# Altium schematic sheet MB1635-TOP.SchDoc: TOP
size A3; Date: Not used; ApprovedBy: Not used; CheckedBy: Not used; Author: Not used; CompanyName: STMicroelectronics; DrawnBy: Not used; Engineer: Not used; Organization: Not used; Address1: Not used; Address2: Not used; Address3: Not used; Address4: Not used; DocumentNumber: 2; Revision: Not used; SheetNumber: 2; SheetTotal: 17; CurrentTime: Not used; CurrentDate: Not used; Time: Not used; DocumentFullPathAndName: Not used; DocumentName: Not used; ModifiedDate: Not used; ImagePath: Not used; ProjectName: Not used; Application_BuildNumber: Not used
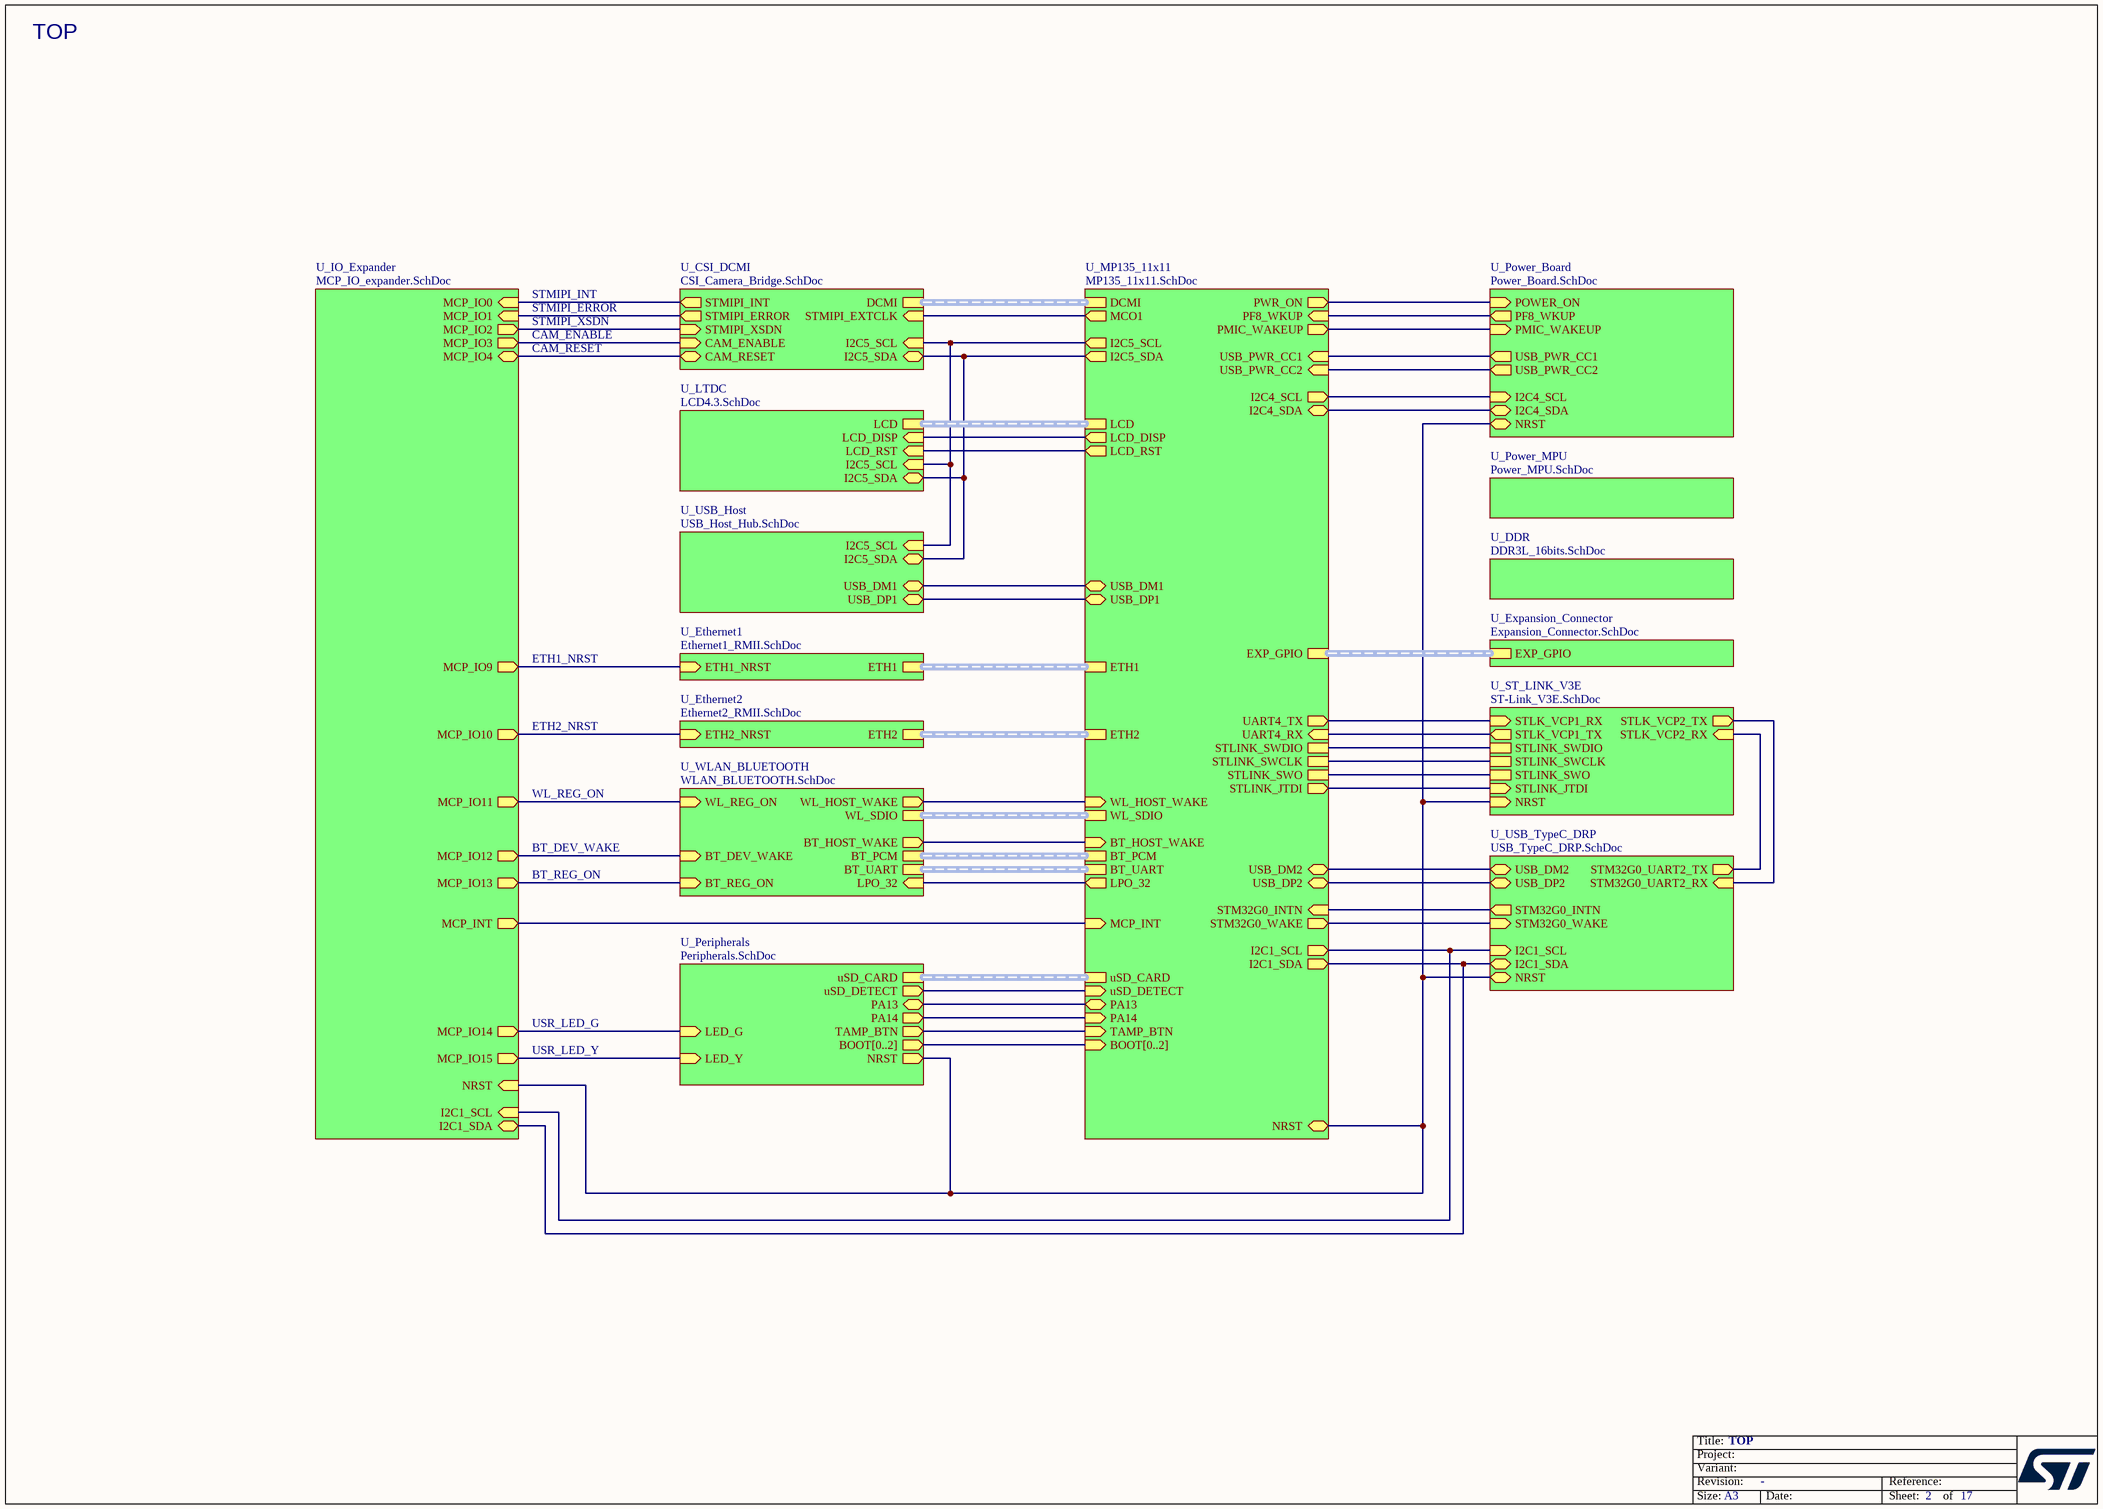
[diagram p0: MB1635-TOP.SchDoc]

## Sub-sheets
U_CSI_DCMI = CSI_Camera_Bridge.SchDoc: DCMI (harness DCMI), I2C5_SCL (in), I2C5_SDA (bidir), STMIPI_EXTCLK (in), STMIPI_ERROR (out), STMIPI_INT (out), CAM_ENABLE (in), CAM_RESET (bidir), STMIPI_XSDN (in)
U_DDR = DDR3L_16bits.SchDoc: no entries
U_Ethernet1 = Ethernet1_RMII.SchDoc: ETH1 (harness ETH1), ETH1_NRST (in)
U_Ethernet2 = Ethernet2_RMII.SchDoc: ETH2 (harness ETH2), ETH2_NRST (in)
U_Expansion_Connector = Expansion_Connector.SchDoc: EXP_GPIO (harness EXP_GPIO)
U_IO_Expander = MCP_IO_expander.SchDoc: MCP_IO1 (in), MCP_IO0 (in), MCP_IO9 (out), MCP_IO10 (out), MCP_IO11 (out), MCP_IO12 (out), MCP_IO13 (out), MCP_IO14 (out), MCP_IO15 (out), I2C1_SCL (in), I2C1_SDA (bidir), MCP_INT (out), NRST (in), MCP_IO3 (out), MCP_IO4 (bidir), MCP_IO2 (out)
U_LTDC = LCD4.3.SchDoc: LCD (harness LCD), I2C5_SCL (in), I2C5_SDA (bidir), LCD_DISP (in), LCD_RST (in)
U_MP135_11x11 = MP135_11x11.SchDoc: uSD_CARD (harness uSD_CARD), PMIC_WAKEUP (out), PF8_WKUP (in), NRST (bidir), PWR_ON (out), ETH2 (harness ETH2), ETH1 (harness ETH1), I2C1_SCL (out), I2C1_SDA (out), I2C4_SCL (out), I2C4_SDA (bidir), UART4_TX (out), UART4_RX (in), LCD (harness LCD), WL_SDIO (harness WL_SDIO), BOOT[0..2] (in), WL_HOST_WAKE (in), BT_HOST_WAKE (in), LPO_32 (out), BT_PCM (harness BT_PCM), BT_UART (harness BT_UART), DCMI (harness DCMI), EXP_GPIO (harness EXP_GPIO), USB_DM1 (bidir), USB_DM2 (bidir), USB_DP1 (bidir), USB_DP2 (bidir), MCO1 (out), USB_PWR_CC1 (in), USB_PWR_CC2 (in), STLINK_SWDIO, STLINK_SWCLK, STLINK_SWO, PA14 (in), PA13 (bidir), STM32G0_INTN (in), STM32G0_WAKE (out), MCP_INT (in), TAMP_BTN (in), uSD_DETECT (in), LCD_DISP (out), LCD_RST (out), I2C5_SCL (out), I2C5_SDA (out), STLINK_JTDI (out)
U_Peripherals = Peripherals.SchDoc: NRST (out), BOOT[0..2] (out), uSD_CARD (harness uSD_CARD), PA13 (bidir), PA14 (out), LED_Y (in), LED_G (in), uSD_DETECT (out), TAMP_BTN (out)
U_Power_Board = Power_Board.SchDoc: I2C4_SDA (bidir), I2C4_SCL (in), PF8_WKUP (out), NRST (bidir), POWER_ON (in), USB_PWR_CC1 (out), USB_PWR_CC2 (out), PMIC_WAKEUP (in)
U_Power_MPU = Power_MPU.SchDoc: no entries
U_ST_LINK_V3E = ST-Link_V3E.SchDoc: STLINK_SWDIO, STLINK_SWCLK, STLINK_SWO, STLK_VCP1_RX (in), STLK_VCP1_TX (out), STLK_VCP2_TX (out), STLK_VCP2_RX (in), NRST (in), STLINK_JTDI (in)
U_USB_Host = USB_Host_Hub.SchDoc: USB_DM1 (bidir), USB_DP1 (bidir), I2C5_SDA (bidir), I2C5_SCL (in)
U_USB_TypeC_DRP = USB_TypeC_DRP.SchDoc: USB_DM2 (bidir), USB_DP2 (bidir), I2C1_SCL (in), I2C1_SDA (bidir), STM32G0_INTN (out), STM32G0_WAKE (in), STM32G0_UART2_TX (out), STM32G0_UART2_RX (in), NRST (bidir)
U_WLAN_BLUETOOTH = WLAN_BLUETOOTH.SchDoc: BT_PCM (harness BT_PCM), BT_UART (harness BT_UART), WL_SDIO (harness WL_SDIO), BT_REG_ON (in), BT_HOST_WAKE (out), BT_DEV_WAKE (in), WL_REG_ON (in), WL_HOST_WAKE (out), LPO_32 (in)

## Nets
(unnamed): sheet U_Ethernet1/ETH1_NRST, sheet U_IO_Expander/MCP_IO9
(unnamed): sheet U_Ethernet2/ETH2_NRST, sheet U_IO_Expander/MCP_IO10
(unnamed): sheet U_Power_Board/I2C4_SDA, sheet U_MP135_11x11/I2C4_SDA
(unnamed): sheet U_Power_Board/I2C4_SCL, sheet U_MP135_11x11/I2C4_SCL
(unnamed): sheet U_Power_Board/PF8_WKUP, sheet U_MP135_11x11/PF8_WKUP
(unnamed): sheet U_Power_Board/NRST, sheet U_ST_LINK_V3E/NRST, sheet U_Peripherals/NRST, sheet U_MP135_11x11/NRST, sheet U_IO_Expander/NRST, sheet U_USB_TypeC_DRP/NRST
(unnamed): sheet U_Power_Board/POWER_ON, sheet U_MP135_11x11/PWR_ON
(unnamed): sheet U_Power_Board/USB_PWR_CC1, sheet U_MP135_11x11/USB_PWR_CC1
(unnamed): sheet U_Power_Board/USB_PWR_CC2, sheet U_MP135_11x11/USB_PWR_CC2
(unnamed): sheet U_Power_Board/PMIC_WAKEUP, sheet U_MP135_11x11/PMIC_WAKEUP
(unnamed): sheet U_ST_LINK_V3E/STLINK_SWDIO, sheet U_MP135_11x11/STLINK_SWDIO
(unnamed): sheet U_ST_LINK_V3E/STLINK_SWCLK, sheet U_MP135_11x11/STLINK_SWCLK
(unnamed): sheet U_ST_LINK_V3E/STLINK_SWO, sheet U_MP135_11x11/STLINK_SWO
(unnamed): sheet U_ST_LINK_V3E/STLK_VCP1_RX, sheet U_MP135_11x11/UART4_TX
(unnamed): sheet U_ST_LINK_V3E/STLK_VCP1_TX, sheet U_MP135_11x11/UART4_RX
(unnamed): sheet U_ST_LINK_V3E/STLK_VCP2_TX, sheet U_USB_TypeC_DRP/STM32G0_UART2_RX
(unnamed): sheet U_ST_LINK_V3E/STLK_VCP2_RX, sheet U_USB_TypeC_DRP/STM32G0_UART2_TX
(unnamed): sheet U_ST_LINK_V3E/STLINK_JTDI, sheet U_MP135_11x11/STLINK_JTDI
(unnamed): sheet U_WLAN_BLUETOOTH/BT_REG_ON, sheet U_IO_Expander/MCP_IO13
(unnamed): sheet U_WLAN_BLUETOOTH/BT_HOST_WAKE, sheet U_MP135_11x11/BT_HOST_WAKE
(unnamed): sheet U_WLAN_BLUETOOTH/BT_DEV_WAKE, sheet U_IO_Expander/MCP_IO12
(unnamed): sheet U_WLAN_BLUETOOTH/WL_REG_ON, sheet U_IO_Expander/MCP_IO11
(unnamed): sheet U_WLAN_BLUETOOTH/WL_HOST_WAKE, sheet U_MP135_11x11/WL_HOST_WAKE
(unnamed): sheet U_WLAN_BLUETOOTH/LPO_32, sheet U_MP135_11x11/LPO_32
(unnamed): sheet U_Peripherals/PA13, sheet U_MP135_11x11/PA13
(unnamed): sheet U_Peripherals/PA14, sheet U_MP135_11x11/PA14
(unnamed): sheet U_Peripherals/LED_Y, sheet U_IO_Expander/MCP_IO15
(unnamed): sheet U_Peripherals/LED_G, sheet U_IO_Expander/MCP_IO14
(unnamed): sheet U_Peripherals/uSD_DETECT, sheet U_MP135_11x11/uSD_DETECT
(unnamed): sheet U_Peripherals/TAMP_BTN, sheet U_MP135_11x11/TAMP_BTN
(unnamed): sheet U_MP135_11x11/I2C1_SCL, sheet U_IO_Expander/I2C1_SCL, sheet U_USB_TypeC_DRP/I2C1_SCL
(unnamed): sheet U_MP135_11x11/I2C1_SDA, sheet U_IO_Expander/I2C1_SDA, sheet U_USB_TypeC_DRP/I2C1_SDA
(unnamed): sheet U_MP135_11x11/USB_DM1, sheet U_USB_Host/USB_DM1
(unnamed): sheet U_MP135_11x11/USB_DM2, sheet U_USB_TypeC_DRP/USB_DM2
(unnamed): sheet U_MP135_11x11/USB_DP1, sheet U_USB_Host/USB_DP1
(unnamed): sheet U_MP135_11x11/USB_DP2, sheet U_USB_TypeC_DRP/USB_DP2
(unnamed): sheet U_MP135_11x11/MCO1, sheet U_CSI_DCMI/STMIPI_EXTCLK
(unnamed): sheet U_MP135_11x11/STM32G0_INTN, sheet U_USB_TypeC_DRP/STM32G0_INTN
(unnamed): sheet U_MP135_11x11/STM32G0_WAKE, sheet U_USB_TypeC_DRP/STM32G0_WAKE
(unnamed): sheet U_MP135_11x11/MCP_INT, sheet U_IO_Expander/MCP_INT
(unnamed): sheet U_MP135_11x11/LCD_DISP, sheet U_LTDC/LCD_DISP
(unnamed): sheet U_MP135_11x11/LCD_RST, sheet U_LTDC/LCD_RST
(unnamed): sheet U_MP135_11x11/I2C5_SCL, sheet U_LTDC/I2C5_SCL, sheet U_USB_Host/I2C5_SCL, sheet U_CSI_DCMI/I2C5_SCL
(unnamed): sheet U_MP135_11x11/I2C5_SDA, sheet U_LTDC/I2C5_SDA, sheet U_USB_Host/I2C5_SDA, sheet U_CSI_DCMI/I2C5_SDA
(unnamed): sheet U_IO_Expander/MCP_IO1, sheet U_CSI_DCMI/STMIPI_ERROR
(unnamed): sheet U_IO_Expander/MCP_IO0, sheet U_CSI_DCMI/STMIPI_INT
(unnamed): sheet U_IO_Expander/MCP_IO3, sheet U_CSI_DCMI/CAM_ENABLE
(unnamed): sheet U_IO_Expander/MCP_IO4, sheet U_CSI_DCMI/CAM_RESET
(unnamed): sheet U_IO_Expander/MCP_IO2, sheet U_CSI_DCMI/STMIPI_XSDN

## Buses and harness runs
bus sheet U_MP135_11x11/BOOT[0..2] = sheet U_Peripherals/BOOT[0..2]
harness sheet U_CSI_DCMI/DCMI = sheet U_MP135_11x11/DCMI
harness sheet U_Ethernet1/ETH1 = sheet U_MP135_11x11/ETH1
harness sheet U_Ethernet2/ETH2 = sheet U_MP135_11x11/ETH2
harness sheet U_Expansion_Connector/EXP_GPIO = sheet U_MP135_11x11/EXP_GPIO
harness sheet U_LTDC/LCD = sheet U_MP135_11x11/LCD
harness sheet U_MP135_11x11/BT_PCM = sheet U_WLAN_BLUETOOTH/BT_PCM
harness sheet U_MP135_11x11/BT_UART = sheet U_WLAN_BLUETOOTH/BT_UART
harness sheet U_MP135_11x11/uSD_CARD = sheet U_Peripherals/uSD_CARD
harness sheet U_MP135_11x11/WL_SDIO = sheet U_WLAN_BLUETOOTH/WL_SDIO

## Notes on the sheet
- TOP
- STMIPI_INT
- STMIPI_ERROR
- CAM_RESET
- CAM_ENABLE
- STMIPI_XSDN
- ETH1_NRST
- ETH2_NRST
- BT_DEV_WAKE
- WL_REG_ON
- BT_REG_ON
- USR_LED_Y
- USR_LED_G
- Title:
- Project:
- Size:
- Revision:
- Variant:
- A3
- -
- Date:
- Reference:
- Sheet:
- of